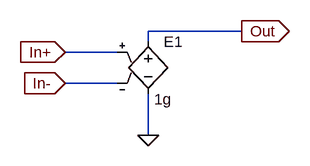
[diagram p0: schematic AO_ideal.asc]
AO_ideal.asc, the LTspice schematic file:
Version 4
SHEET 1 880 680
WIRE 272 96 128 96
WIRE 128 112 128 96
WIRE 80 128 0 128
WIRE 80 176 0 176
WIRE 128 256 128 192
FLAG 128 256 0
FLAG 0 128 In+
IOPIN 0 128 In
FLAG 272 96 Out
IOPIN 272 96 Out
FLAG 0 176 In-
IOPIN 0 176 In
SYMBOL e 128 96 R0
WINDOW 3 9 105 Left 2
SYMATTR Value 1g
SYMATTR InstName E1

The netlist it stands for:
* AO_ideal.asc
E1 Out 0 In+ In- 1g
.backanno
.end